# EAGLE design mr_radar_patch_antenna (EAGLE 5.11)
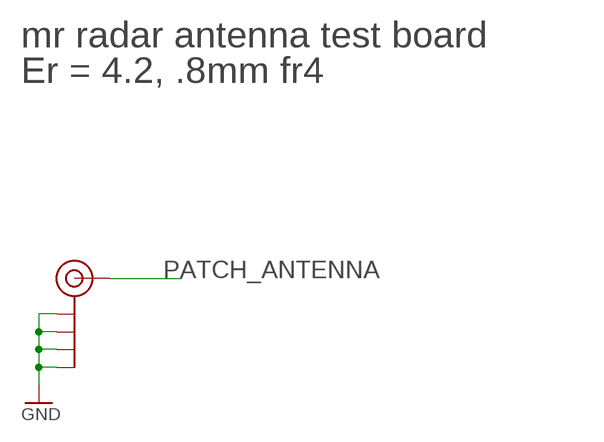
[diagram p0: schematic, sheet 1]

## Parts
J$1  SMA_EDGE  [SMA-EDGE]

## Nets
GND: J$1.GND@0(GND) J$1.GND@1(GND) J$1.GND@2(GND) J$1.GND@3(GND)
PATCH_ANTENNA: J$1.SIG(SIGNAL)

## Notes on the sheet
- mr radar antenna test board
- Er = 4.2, .8mm fr4

## Library data of the parts
J$1 = SparkFun:SMA_EDGE: SMA Antenna Connector End launch SMA connector. The paste layer has been removed so that the connector can be hand soldered onto the board after reflow.

## Board
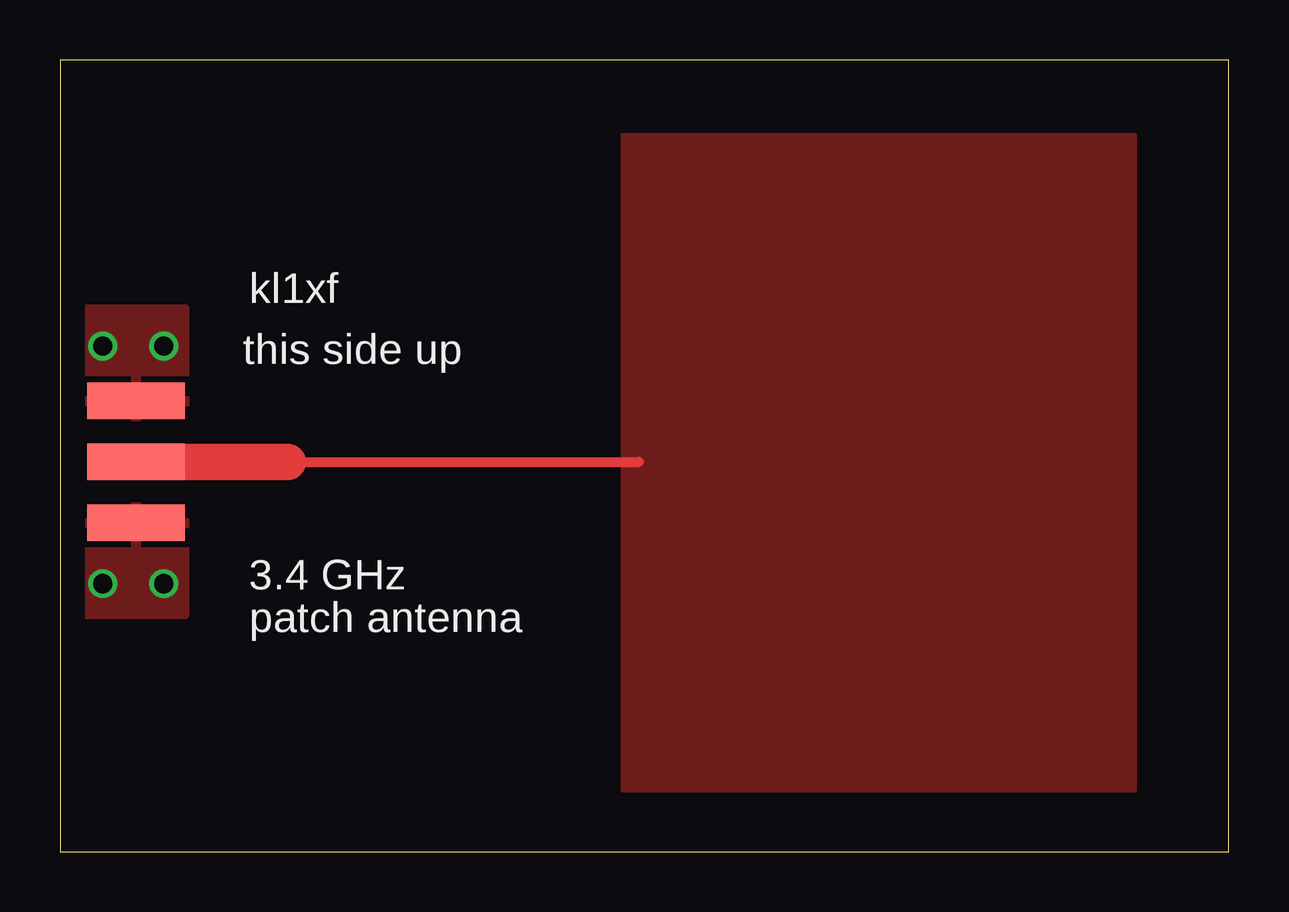
[diagram p1: board, top side]
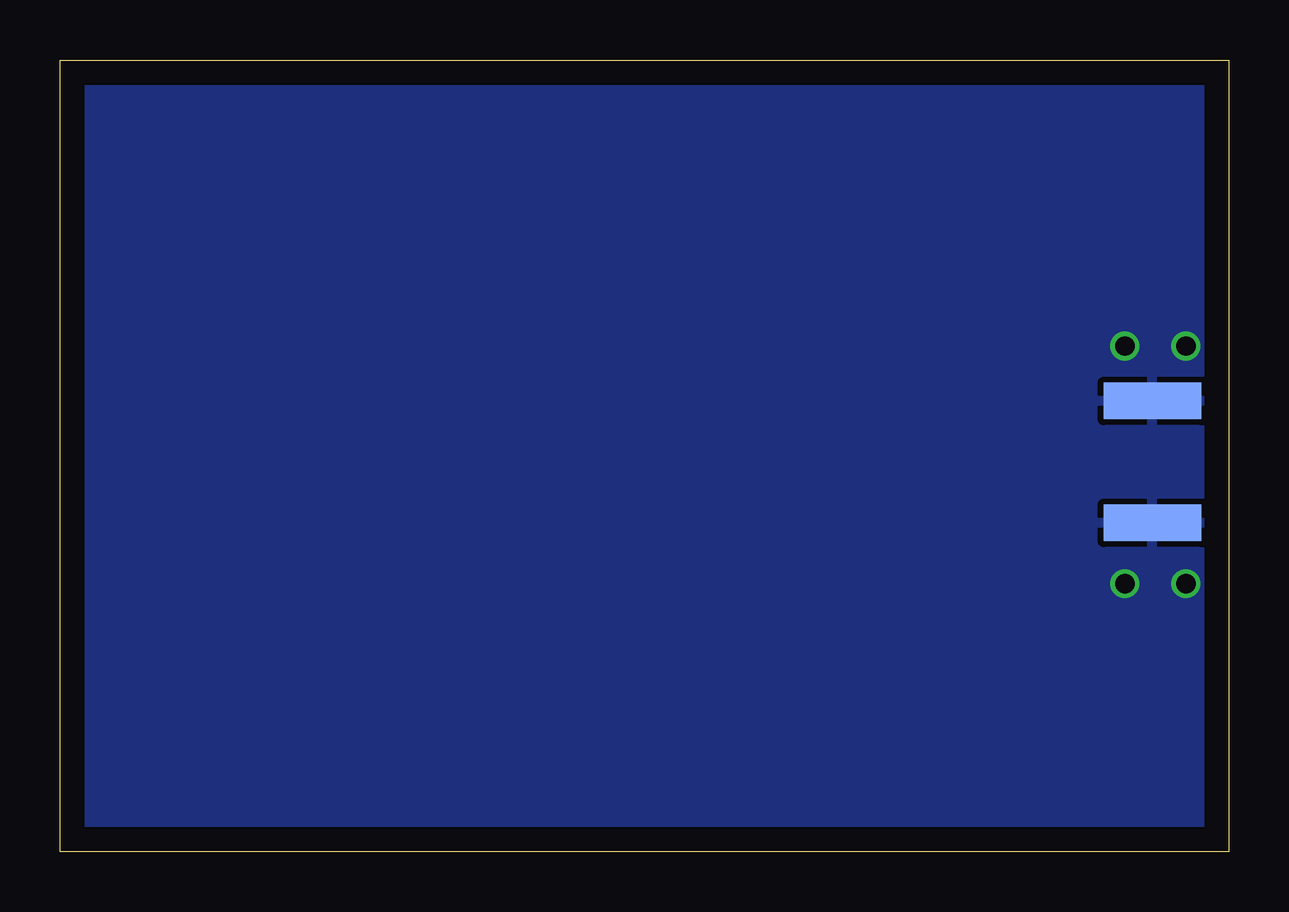
[diagram p2: board, bottom side, seen from below]

Size 48.69 x 33.01 mm. Coordinates in mm from the lower left corner, seen from the top.
Outline: 0,0 48.69,0 48.69,33.01 0,33.01 0,0
Copper layers (1*16): Top 0.035mm / dielectric 1.5mm / Bottom 0.035mm
Design rules "default": minimum track width 10mil, minimum drill 24mil, track to track 8mil, track to pad 8mil, pad to pad 8mil, via to via 8mil, smd to smd 8mil, copper to edge 40mil, drill to drill 8mil, minimum pad ring 10mil, minimum via ring 8mil, stop-mask expansion 4mil, vias tented up to drill 0mil, thermal gap 10mil

### Footprints (pad centres in the part's own frame; a part is rotated, then mirrored left to right if it is on the bottom)
SMA-EDGE = smd 1.524 x 4.064: GND@0 0,0; GND@1 5.08,0; SIG 2.54,0 | smd 1.524 x 4.064 bottom: GND@2 0,0; GND@3 5.08,0

### Placement (x,y rotation side)
J$1  3.17,18.8 270 top

### Tracks (layer width: path | path; a pad name or v marks a point on that pad's centre or on a via)
GND  (via drill 0.8)
  other vias: 1.78,11.18 4.32,11.18 4.32,21.08 1.78,21.08
  pour Bottom: 0,40.39 0,-6.6 60.83,-6.6 60.83,40.39
  pour Top: 0.64,14.35 0.64,9.91 5.21,9.91 5.21,14.35
  pour Top: 0.64,18.16 5.21,18.16 5.21,22.61 0.64,22.61
N$1
  Top 0.406: 9.5,16.26 24.13,16.26
  Top 1.524: 1.91,16.26 9.5,16.26
  pour Top: 23.42,2.54 44.81,2.54 44.81,29.9 23.42,29.9

### Text on the board
tPlace: kl1xf | this side up | 3.4 GHz | patch antenna